# EAGLE design SwitchBoard_MP3_40 (EAGLE 9.6.2)
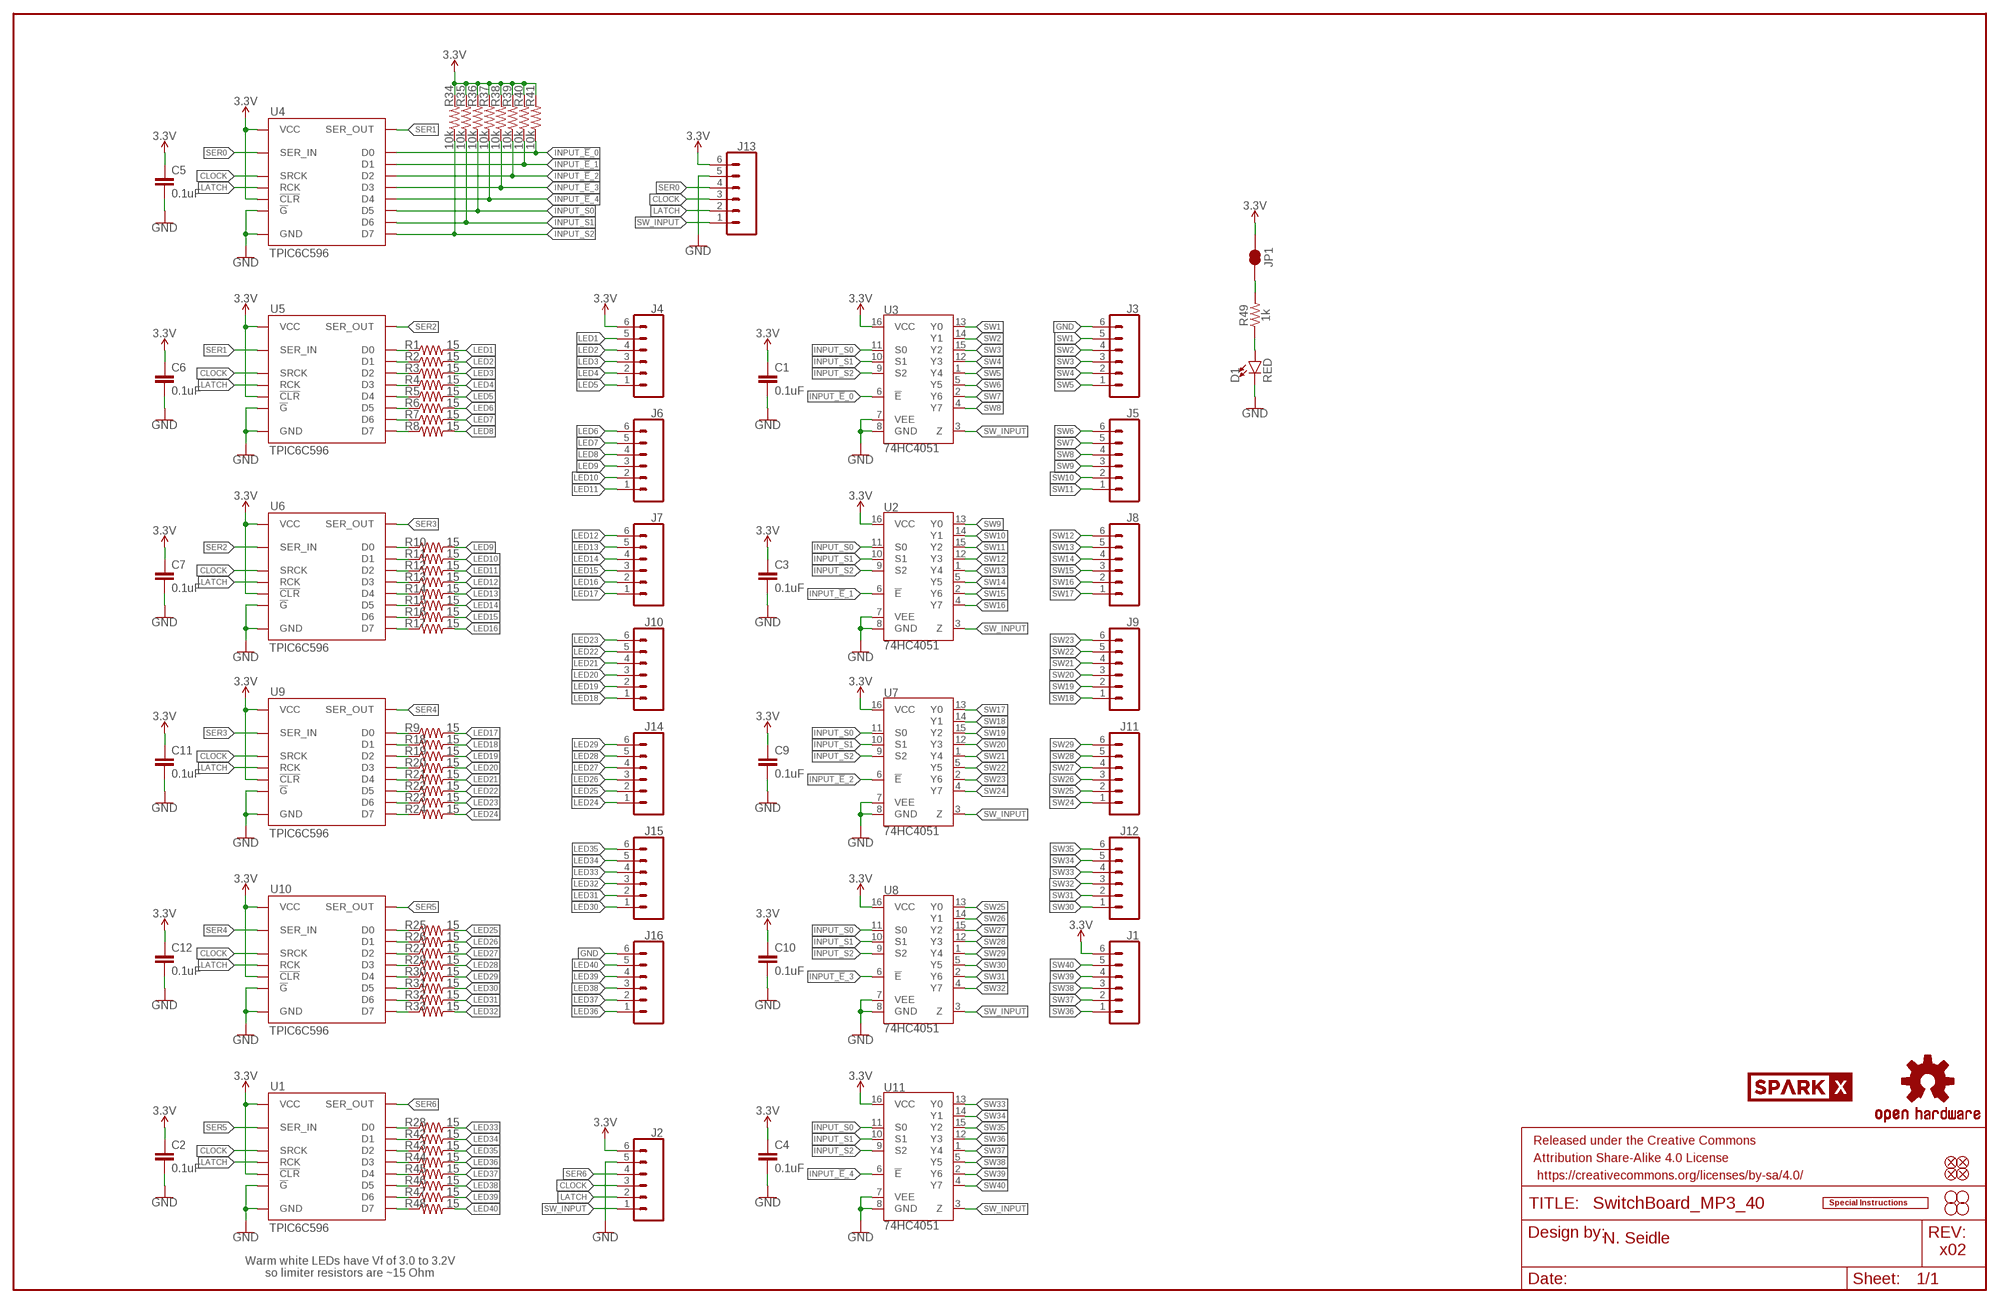
[diagram p0: schematic, sheet 1]

## Parts
C1  0.1uF  0.1UF-0603-25V-10%-X7R-WE  [0603]
C2  0.1uF  0.1UF-0603-25V-10%-X7R-WE  [0603]
C3  0.1uF  0.1UF-0603-25V-10%-X7R-WE  [0603]
C4  0.1uF  0.1UF-0603-25V-10%-X7R-WE  [0603]
C5  0.1uF  0.1UF-0603-25V-10%-X7R-WE  [0603]
C6  0.1uF  0.1UF-0603-25V-10%-X7R-WE  [0603]
C7  0.1uF  0.1UF-0603-25V-10%-X7R-WE  [0603]
C9  0.1uF  0.1UF-0603-25V-10%-X7R-WE  [0603]
C10  0.1uF  0.1UF-0603-25V-10%-X7R-WE  [0603]
C11  0.1uF  0.1UF-0603-25V-10%-X7R-WE  [0603]
C12  0.1uF  0.1UF-0603-25V-10%-X7R-WE  [0603]
D1  RED  LED-RED0603  [LED-0603]
FD1  FIDUCIAL1X2  [FIDUCIAL-1X2]
FD2  FIDUCIAL1X2  [FIDUCIAL-1X2]
FD3  FIDUCIAL1X2  [FIDUCIAL-1X2]
FD4  FIDUCIAL1X2  [FIDUCIAL-1X2]
FRAME2  FRAME-LEDGER  [CREATIVE_COMMONS]
H1  STAND-OFF  [STAND-OFF]
H2  STAND-OFF  [STAND-OFF]
H3  STAND-OFF  [STAND-OFF]
H4  STAND-OFF  [STAND-OFF]
J1  CONN_06JST-SMD-LOCKING  [JST-6-SMD-1.25MM-LOCKING]
J2  CONN_06JST-SMD-LOCKING  [JST-6-SMD-1.25MM-LOCKING]
J3  CONN_06JST-SMD-LOCKING  [JST-6-SMD-1.25MM-LOCKING]
J4  CONN_06JST-SMD-LOCKING  [JST-6-SMD-1.25MM-LOCKING]
J5  CONN_06JST-SMD-LOCKING  [JST-6-SMD-1.25MM-LOCKING]
J6  CONN_06JST-SMD-LOCKING  [JST-6-SMD-1.25MM-LOCKING]
J7  CONN_06JST-SMD-LOCKING  [JST-6-SMD-1.25MM-LOCKING]
J8  CONN_06JST-SMD-LOCKING  [JST-6-SMD-1.25MM-LOCKING]
J9  CONN_06JST-SMD-LOCKING  [JST-6-SMD-1.25MM-LOCKING]
J10  CONN_06JST-SMD-LOCKING  [JST-6-SMD-1.25MM-LOCKING]
J11  CONN_06JST-SMD-LOCKING  [JST-6-SMD-1.25MM-LOCKING]
J12  CONN_06JST-SMD-LOCKING  [JST-6-SMD-1.25MM-LOCKING]
J13  CONN_06JST-SMD-LOCKING  [JST-6-SMD-1.25MM-LOCKING]
J14  CONN_06JST-SMD-LOCKING  [JST-6-SMD-1.25MM-LOCKING]
J15  CONN_06JST-SMD-LOCKING  [JST-6-SMD-1.25MM-LOCKING]
J16  CONN_06JST-SMD-LOCKING  [JST-6-SMD-1.25MM-LOCKING]
JP1  JUMPER-SMT_2_NC_TRACE_SILK  [SMT-JUMPER_2_NC_TRACE_SILK]
LOGO1  SPECIAL_INSTRUCTIONS-ORDERING  [ORDERING_INSTRUCTIONS]
LOGO2  OSHW-LOGOS  [OSHW-LOGO-S]
R1  15  15OHM-0603-1/10W-1%  [0603]
R2  15  15OHM-0603-1/10W-1%  [0603]
R3  15  15OHM-0603-1/10W-1%  [0603]
R4  15  15OHM-0603-1/10W-1%  [0603]
R5  15  15OHM-0603-1/10W-1%  [0603]
R6  15  15OHM-0603-1/10W-1%  [0603]
R7  15  15OHM-0603-1/10W-1%  [0603]
R8  15  15OHM-0603-1/10W-1%  [0603]
R9  15  15OHM-0603-1/10W-1%  [0603]
R10  15  15OHM-0603-1/10W-1%  [0603]
R11  15  15OHM-0603-1/10W-1%  [0603]
R12  15  15OHM-0603-1/10W-1%  [0603]
R13  15  15OHM-0603-1/10W-1%  [0603]
R14  15  15OHM-0603-1/10W-1%  [0603]
R15  15  15OHM-0603-1/10W-1%  [0603]
R16  15  15OHM-0603-1/10W-1%  [0603]
R17  15  15OHM-0603-1/10W-1%  [0603]
R18  15  15OHM-0603-1/10W-1%  [0603]
R19  15  15OHM-0603-1/10W-1%  [0603]
R20  15  15OHM-0603-1/10W-1%  [0603]
R21  15  15OHM-0603-1/10W-1%  [0603]
R22  15  15OHM-0603-1/10W-1%  [0603]
R23  15  15OHM-0603-1/10W-1%  [0603]
R24  15  15OHM-0603-1/10W-1%  [0603]
R25  15  15OHM-0603-1/10W-1%  [0603]
R26  15  15OHM-0603-1/10W-1%  [0603]
R27  15  15OHM-0603-1/10W-1%  [0603]
R28  15  15OHM-0603-1/10W-1%  [0603]
R29  15  15OHM-0603-1/10W-1%  [0603]
R30  15  15OHM-0603-1/10W-1%  [0603]
R31  15  15OHM-0603-1/10W-1%  [0603]
R32  15  15OHM-0603-1/10W-1%  [0603]
R33  15  15OHM-0603-1/10W-1%  [0603]
R34  10k  10KOHM-0603-1/10W-1%  [0603]
R35  10k  10KOHM-0603-1/10W-1%  [0603]
R36  10k  10KOHM-0603-1/10W-1%  [0603]
R37  10k  10KOHM-0603-1/10W-1%  [0603]
R38  10k  10KOHM-0603-1/10W-1%  [0603]
R39  10k  10KOHM-0603-1/10W-1%  [0603]
R40  10k  10KOHM-0603-1/10W-1%  [0603]
R41  10k  10KOHM-0603-1/10W-1%  [0603]
R42  15  15OHM-0603-1/10W-1%  [0603]
R43  15  15OHM-0603-1/10W-1%  [0603]
R44  15  15OHM-0603-1/10W-1%  [0603]
R45  15  15OHM-0603-1/10W-1%  [0603]
R46  15  15OHM-0603-1/10W-1%  [0603]
R47  15  15OHM-0603-1/10W-1%  [0603]
R48  15  15OHM-0603-1/10W-1%  [0603]
R49  1k  1KOHM-0603-1/10W-1%  [0603]
U1  TPIC6C596  TPIC6C596SOIC  [SO016]
U2  74HC4051  744051  [SO16]
U3  74HC4051  744051  [SO16]
U4  TPIC6C596  TPIC6C596SOIC  [SO016]
U5  TPIC6C596  TPIC6C596SOIC  [SO016]
U6  TPIC6C596  TPIC6C596SOIC  [SO016]
U7  74HC4051  744051  [SO16]
U8  74HC4051  744051  [SO16]
U9  TPIC6C596  TPIC6C596SOIC  [SO016]
U10  TPIC6C596  TPIC6C596SOIC  [SO016]
U11  74HC4051  744051  [SO16]
U$1  SPARKX-LOGO4  [SPARKX-MEDIUM]

## Nets
3.3V: C1.1 C2.1 C3.1 C4.1 C5.1 C6.1 C7.1 C9.1 C10.1 C11.1 C12.1 J1.6 J2.6 J4.6 J13.6 JP1.2 R34.2 R35.2 R36.2 R37.2 R38.2 R39.2 R40.2 R41.2 U1.1(VCC) U1.7(!CLR) U2.16(VCC) U3.16(VCC) U4.1(VCC) U4.7(!CLR) U5.1(VCC) U5.7(!CLR) U6.1(VCC) U6.7(!CLR) U7.16(VCC) U8.16(VCC) U9.1(VCC) U9.7(!CLR) U10.1(VCC) U10.7(!CLR) U11.16(VCC)
CLOCK: J2.3 J13.3 U1.15(SRCK) U4.15(SRCK) U5.15(SRCK) U6.15(SRCK) U9.15(SRCK) U10.15(SRCK)
GND: C1.2 C2.2 C3.2 C4.2 C5.2 C6.2 C7.2 C9.2 C10.2 C11.2 C12.2 D1.C J2.5 J3.6 J13.5 J16.6 U1.8(!G) U1.16(GND) U2.7(VEE) U2.8(GND) U3.7(VEE) U3.8(GND) U4.8(!G) U4.16(GND) U5.8(!G) U5.16(GND) U6.8(!G) U6.16(GND) U7.7(VEE) U7.8(GND) U8.7(VEE) U8.8(GND) U9.8(!G) U9.16(GND) U10.8(!G) U10.16(GND) U11.7(VEE) U11.8(GND)
INPUT_!E!_0: R41.1 U3.6(!E!) U4.3(D0)
INPUT_!E!_1: R40.1 U2.6(!E!) U4.4(D1)
INPUT_!E!_2: R39.1 U4.5(D2) U7.6(!E!)
INPUT_!E!_3: R38.1 U4.6(D3) U8.6(!E!)
INPUT_!E!_4: R37.1 U4.11(D4) U11.6(!E!)
INPUT_S0: R36.1 U2.11(S0) U3.11(S0) U4.12(D5) U7.11(S0) U8.11(S0) U11.11(S0)
INPUT_S1: R35.1 U2.10(S1) U3.10(S1) U4.13(D6) U7.10(S1) U8.10(S1) U11.10(S1)
INPUT_S2: R34.1 U2.9(S2) U3.9(S2) U4.14(D7) U7.9(S2) U8.9(S2) U11.9(S2)
LATCH: J2.2 J13.2 U1.10(RCK) U4.10(RCK) U5.10(RCK) U6.10(RCK) U9.10(RCK) U10.10(RCK)
LED1: J4.5 R1.2
LED2: J4.4 R2.2
LED3: J4.3 R3.2
LED4: J4.2 R4.2
LED5: J4.1 R5.2
LED6: J6.6 R6.2
LED7: J6.5 R7.2
LED8: J6.4 R8.2
LED9: J6.3 R10.2
LED10: J6.2 R11.2
LED11: J6.1 R12.2
LED12: J7.6 R13.2
LED13: J7.5 R14.2
LED14: J7.4 R15.2
LED15: J7.3 R16.2
LED16: J7.2 R17.2
LED17: J7.1 R9.2
LED18: J10.1 R18.2
LED19: J10.2 R19.2
LED20: J10.3 R20.2
LED21: J10.4 R21.2
LED22: J10.5 R22.2
LED23: J10.6 R23.2
LED24: J14.1 R24.2
LED25: J14.2 R25.2
LED26: J14.3 R26.2
LED27: J14.4 R27.2
LED28: J14.5 R29.2
LED29: J14.6 R30.2
LED30: J15.1 R31.2
LED31: J15.2 R32.2
LED32: J15.3 R33.2
LED33: J15.4 R28.2
LED34: J15.5 R42.2
LED35: J15.6 R43.2
LED36: J16.1 R44.2
LED37: J16.2 R45.2
LED38: J16.3 R46.2
LED39: J16.4 R47.2
LED40: J16.5 R48.2
N$1: R1.1 U5.3(D0)
N$2: R2.1 U5.4(D1)
N$3: R3.1 U5.5(D2)
N$4: R4.1 U5.6(D3)
N$5: R5.1 U5.11(D4)
N$6: R6.1 U5.12(D5)
N$7: R7.1 U5.13(D6)
N$8: R8.1 U5.14(D7)
N$9: R9.1 U9.3(D0)
N$10: R10.1 U6.3(D0)
N$11: R11.1 U6.4(D1)
N$12: R12.1 U6.5(D2)
N$13: R13.1 U6.6(D3)
N$14: R14.1 U6.11(D4)
N$15: R15.1 U6.12(D5)
N$16: R16.1 U6.13(D6)
N$17: R17.1 U6.14(D7)
N$18: R18.1 U9.4(D1)
N$19: R19.1 U9.5(D2)
N$20: R20.1 U9.6(D3)
N$21: R21.1 U9.11(D4)
N$22: R22.1 U9.12(D5)
N$23: R23.1 U9.13(D6)
N$24: R24.1 U9.14(D7)
N$25: R25.1 U10.3(D0)
N$26: R26.1 U10.4(D1)
N$27: R27.1 U10.5(D2)
N$28: R29.1 U10.6(D3)
N$29: R30.1 U10.11(D4)
N$30: R31.1 U10.12(D5)
N$31: R32.1 U10.13(D6)
N$32: R33.1 U10.14(D7)
N$33: R28.1 U1.3(D0)
N$34: R42.1 U1.4(D1)
N$35: R43.1 U1.5(D2)
N$36: R44.1 U1.6(D3)
N$37: R45.1 U1.11(D4)
N$38: R46.1 U1.12(D5)
N$39: R47.1 U1.13(D6)
N$40: R48.1 U1.14(D7)
N$41: D1.A R49.1
N$42: JP1.1 R49.2
SER0: J13.4 U4.2(SER_IN)
SER1: U4.9(SER_OUT) U5.2(SER_IN)
SER2: U5.9(SER_OUT) U6.2(SER_IN)
SER3: U6.9(SER_OUT) U9.2(SER_IN)
SER4: U9.9(SER_OUT) U10.2(SER_IN)
SER5: U1.2(SER_IN) U10.9(SER_OUT)
SER6: J2.4 U1.9(SER_OUT)
SW1: J3.5 U3.13(Y0)
SW2: J3.4 U3.14(Y1)
SW3: J3.3 U3.15(Y2)
SW4: J3.2 U3.12(Y3)
SW5: J3.1 U3.1(Y4)
SW6: J5.6 U3.5(Y5)
SW7: J5.5 U3.2(Y6)
SW8: J5.4 U3.4(Y7)
SW9: J5.3 U2.13(Y0)
SW10: J5.2 U2.14(Y1)
SW11: J5.1 U2.15(Y2)
SW12: J8.6 U2.12(Y3)
SW13: J8.5 U2.1(Y4)
SW14: J8.4 U2.5(Y5)
SW15: J8.3 U2.2(Y6)
SW16: J8.2 U2.4(Y7)
SW17: J8.1 U7.13(Y0)
SW18: J9.1 U7.14(Y1)
SW19: J9.2 U7.15(Y2)
SW20: J9.3 U7.12(Y3)
SW21: J9.4 U7.1(Y4)
SW22: J9.5 U7.5(Y5)
SW23: J9.6 U7.2(Y6)
SW24: J11.1 U7.4(Y7)
SW25: J11.2 U8.13(Y0)
SW26: J11.3 U8.14(Y1)
SW27: J11.4 U8.15(Y2)
SW28: J11.5 U8.12(Y3)
SW29: J11.6 U8.1(Y4)
SW30: J12.1 U8.5(Y5)
SW31: J12.2 U8.2(Y6)
SW32: J12.3 U8.4(Y7)
SW33: J12.4 U11.13(Y0)
SW34: J12.5 U11.14(Y1)
SW35: J12.6 U11.15(Y2)
SW36: J1.1 U11.12(Y3)
SW37: J1.2 U11.1(Y4)
SW38: J1.3 U11.5(Y5)
SW39: J1.4 U11.2(Y6)
SW40: J1.5 U11.4(Y7)
SW_INPUT: J2.1 J13.1 U2.3(Z) U3.3(Z) U7.3(Z) U8.3(Z) U11.3(Z)

## Notes on the sheet
- N. Seidle
- x02
- Warm white LEDs have Vf of 3.0 to 3.2V
  so limiter resistors are ~15 Ohm

## Library data of the parts
C1-C7 C9-C12 = SparkFun-Capacitors:0.1UF: 0.1µF ceramic capacitors A capacitor is a passive two-terminal electrical component used to store electrical energy temporarily in an electric field.; PROD_ID: CAP-16503
D1 = SparkFun-LED:LED-RED: Red SMD LED Used in manufacturing of most products at SparkFun Packages: 0603 - SMD 0603 package [Product Link] <http://docs.avagotech.com/docs/AV02-0551EN> 0603 SMART - SMD 0603 SMART package ( more efficient and expensive)[Product Link] <http://www.osram-os.com/Graphics/XPic2/00077099_0.pdf> 1206 - SMD1206 package [Product Link] <https://www.sparkfun.com/datasheets/DevTools/LilyPad/Q150OVS4.pdff> SparkFun Products: Pro Mini 328 -5V <https://www.sparkfun.com/products/821> RedBoard <https://www.sparkfun.com/products/12757> IOIO-OTG <https://www.sparkfun.com/products/13613>; PROD_ID: DIO-00819
FD1-FD4 = SparkFun-Aesthetics:FIDUCIAL: Fiducial Alignment Points Point-of-reference for pick-and-place machines and other optical instruments.
FRAME2 = SparkFun-Aesthetics:FRAME-LEDGER: Schematic Frame - Ledger Standard 11x14 US Ledger frame
H1-H4 = SparkFun-Hardware:STAND-OFF: Stand Off Drill holes for mechanically mounting via screws, standoffs, etc. Note: Use the keepout ring to avoid running the screw head into surrounding components. Variant Overviews STAND-OFF - Mechanical footprint for a #4 phillips button head screw. STAND-OFF-TIGHT - Mechanical footprint for a #4 phillips button head screw, Example SparkFun Products Screw - Phillips Head (1/4", 4-40, 10 pack) <https://www.sparkfun.com/products/10453> (PRT-10453) Screw - Phillips Head (1/2", 4-40, 10 pack) <https://www.sparkfun.com/products/10452> (PRT-10452) Screw - Phillips Head (3/4", 4-40, 10 pack) <https://www.sparkfun.com/products/10451> (PRT-10451) Screw - Phillips Head (1", 4-40, 10 pack) <https://www.sparkfun.com/products/10450> (PRT-10450)
J1-J16 = SparkFun-Connectors:CONN_06: Multi connection point. Often used as Generic Header-pin footprint for 0.1 inch spaced/style header connections On any of the 0.1 inch spaced packages, you can populate with these: Break Away Headers - Straight <https://www.sparkfun.com/products/116> (PRT-00116) Break Away Male Headers - Right Angle <https://www.sparkfun.com/products/553> (PRT-00553) Female Headers <https://www.sparkfun.com/products/115> (PRT-00115) Break Away Headers - Machine Pin <https://www.sparkfun.com/products/117> (PRT-00117) Break Away Female Headers - Swiss Machine Pin <https://www.sparkfun.com/products/743> (PRT-00743) Arduino Stackable Header - 6 Pin <https://www.sparkfun.com/products/9280> (PRT-09280) Screw Terminals 2.54mm Pitch (6-Pin) <https://www.sparkfun.com/products/16499> (PRT-16499) For SCREWTERMINALS and SPRING TERMINALS visit here: Screw Terimnals on SparkFun.com <https://www.sparkfun.com/search/results?term=Screw+Terminals> (5mm/3.5mm/2.54mm spacing) This device is also useful as a general connection point to wire up your design to another part of your project. Our various solder wires solder well into these plated through hole pads. Hook-Up Wire - Assortment (Stranded, 22 AWG) <https://www.sparkfun.com/products/11375> (PRT-11375) Hook-Up Wire - Assortment (Solid Core, 22 AWG) <https://www.sparkfun.com/products/11367> (PRT-11367) View the entire wire category on our website here <https://www.sparkfun.com/categories/141>; PROD_ID: CONN-16497
JP1 = SparkFun-Jumpers:JUMPER-SMT_2_NC_TRACE: Normally closed trace jumper This jumper has a trace between two pads so it's normally closed (NC). Use a razor knife to open the connection. For best results follow the IPC guidelines for cutting traces: Cutout at least 0.063 mm (0.005 in). Remove all loose material to clean up the cut area. Seal the cut with an approved epoxy. Reapply solder to reclose the connection.
LOGO1 = SparkFun-Aesthetics:SPECIAL_INSTRUCTIONS: Special Ordering/Production Instructions Alert Symbol for special PCB ordering instructions or unique production process warnings. Ordering Instructions Production Instructions Types of information that should be added to box: Copper weight Soldermask color Silk color PCB thickness Number of layers PCB Standard: 1.6mm FR4 1 oz copper immersion silver plating red soldermask white silkscreen Types of information that should be added to box: Special wash requirements Depaneling instructions Humidification Glue curing Default text settings: 0.07 inch 9% ratio 50% line distance
LOGO2 = SparkFun-Aesthetics:OSHW-LOGO: Open-Source Hardware (OSHW) Logo This logo indicates the piece of hardware it is found on incorporates a OSHW license and/or adheres to the definition of open source hardware found here: http://freedomdefined.org/OSHW
R1-R33 R42-R48 = SparkFun-Resistors:15OHM: 15Ω resistor A resistor is a passive two-terminal electrical component that implements electrical resistance as a circuit element. Resistors act to reduce current flow, and, at the same time, act to lower voltage levels within circuits. - Wikipedia; PROD_ID: RES-12570
R34-R41 = SparkFun-Resistors:10KOHM: 10kΩ resistor A resistor is a passive two-terminal electrical component that implements electrical resistance as a circuit element. Resistors act to reduce current flow, and, at the same time, act to lower voltage levels within circuits. - Wikipedia; PROD_ID: RES-00824
R49 = SparkFun-Resistors:1KOHM: 1kΩ resistor A resistor is a passive two-terminal electrical component that implements electrical resistance as a circuit element. Resistors act to reduce current flow, and, at the same time, act to lower voltage levels within circuits. - Wikipedia; PROD_ID: RES-07856
U1 U4-U6 U9 U10 = SparkFun-DigitalIC:TPIC6C596: SMD version of the popular sink driver. This version can sink up to 100mA per channel; PROD_ID: IC-12522
U2 U3 U7 U8 U11 = AnalogMux:74*4051: NXP 74HC4051 8-Channel Analog Multiplexer/Demultiplexer The 74HC4051; 74HCT4051 is a single-pole octal-throw analog switch (SP8T) suitable for use in analog or digital 8:1 multiplexer/demultiplexer applications. The switch features three digital select inputs (S0, S1 and S2), eight independent inputs/outputs (Yn), a common input/output (Z) and a digital enable input (E). When E is HIGH, the switches are turned off. Inputs include clamp diodes. This enables the use of current limiting resistors to interface inputs to voltages in excess of VCC. Datasheet <http://www.nxp.com/documents/data_sheet/74HC_HCT4051.pdf>
U$1 = SparkX:SPARKX-LOGO

## Net classes
1 power: width 0.254 mm

## Board
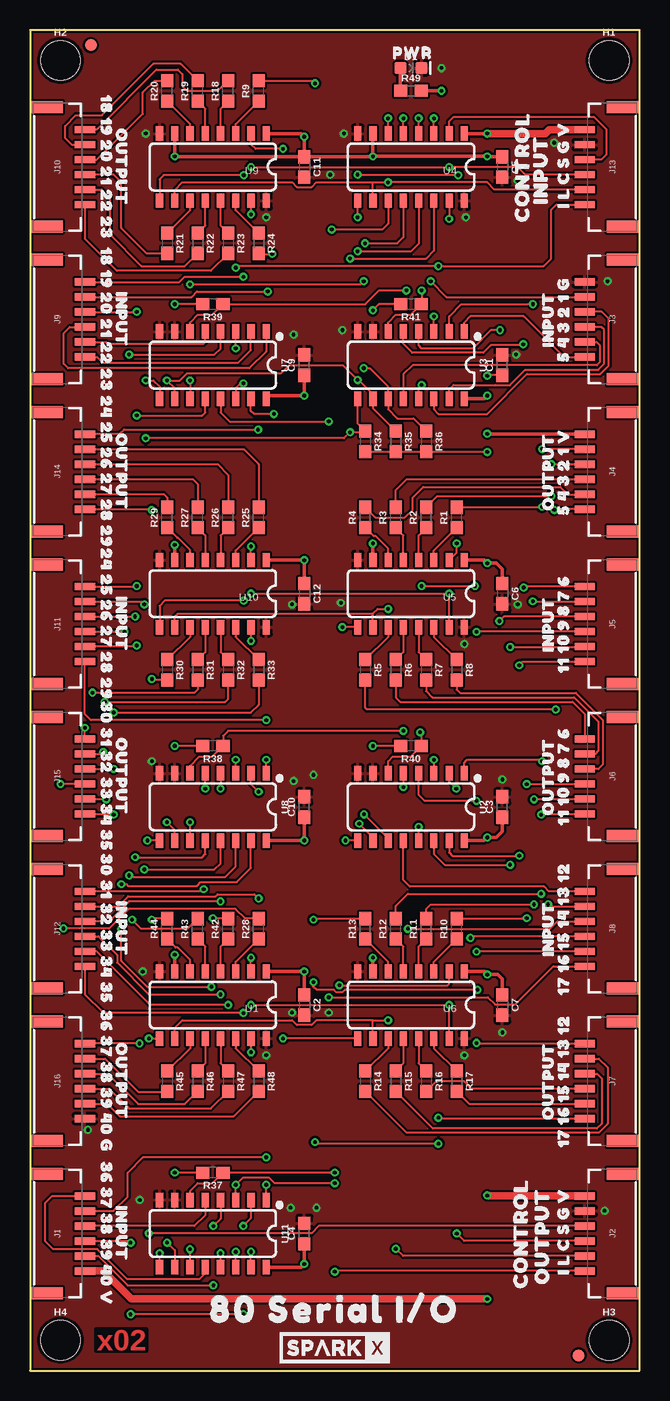
[diagram p1: board, top side]
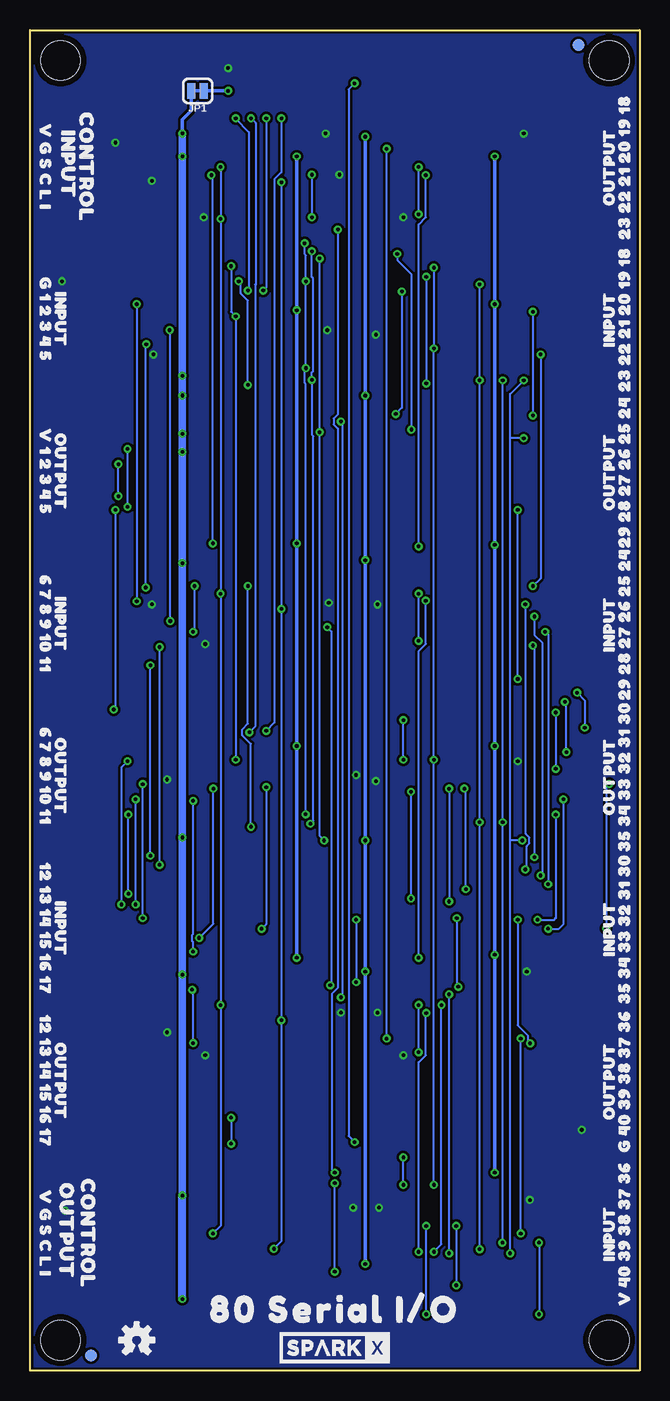
[diagram p2: board, bottom side, seen from below]

Size 50.8 x 111.76 mm. Coordinates in mm from the lower left corner, seen from the top.
Outline: 0,0 50.8,0 50.8,111.76 0,111.76 0,0
Copper layers (1*16): Top 0.035mm / dielectric 1.5mm / Bottom 0.035mm
Design rules "SparkFun-2-Layer-General-JLCPCB": minimum track width 7mil, minimum drill 0.3mm, track to track 7mil, track to pad 7mil, pad to pad 7mil, via to via 7mil, smd to smd 7mil, copper to edge 7mil, drill to drill 7mil, minimum pad ring 7mil, minimum via ring 7mil, stop-mask expansion 3mil, vias tented up to drill 25mil, thermal gap 10mil

### Footprints (pad centres in the part's own frame; a part is rotated, then mirrored left to right if it is on the bottom)
0603 = smd 1.1 x 1: 1 -0.85,0; 2 0.85,0
LED-0603 = smd 1 x 1: A -0.877,0; C 0.877,0
FIDUCIAL-1X2 = smd 1 x 1: 1 0,0
STAND-OFF = hole 3.302: 0,0
JST-6-SMD-1.25MM-LOCKING = smd 0.6 x 1.7: 1 -3.125,3.3; 2 -1.875,3.3; 3 -0.625,3.3; 4 0.625,3.3; 5 1.875,3.3; 6 3.125,3.3 | smd 1 x 2.7: NC1 4.975,0.1; NC2 -4.975,0.1
SMT-JUMPER_2_NC_TRACE_SILK = smd 0.66 x 1.27: 1 -0.521,0; 2 0.521,0
SO016 = smd 0.6 x 1.2: 1 -4.445,-2.8; 2 -3.175,-2.8; 3 -1.905,-2.8; 4 -0.635,-2.8; 5 0.635,-2.8; 6 1.905,-2.8; 7 3.175,-2.8; 8 4.445,-2.8; 9 4.445,2.8; 10 3.175,2.8; 11 1.905,2.8; 12 0.635,2.8; 13 -0.635,2.8; 14 -1.905,2.8; 15 -3.175,2.8; 16 -4.445,2.8
SO16 = smd 0.6 x 1.2: 1 -4.445,-2.8; 2 -3.175,-2.8; 3 -1.905,-2.8; 4 -0.635,-2.8; 5 0.635,-2.8; 6 1.905,-2.8; 7 3.175,-2.8; 8 4.445,-2.8; 9 4.445,2.8; 10 3.175,2.8; 11 1.905,2.8; 12 0.635,2.8; 13 -0.635,2.8; 14 -1.905,2.8; 15 -3.175,2.8; 16 -4.445,2.8

### Placement (x,y rotation side)
C1  39.37,83.82 90 top
C2  22.86,30.48 270 top
C3  39.37,46.99 90 top
C4  22.86,11.43 90 top
C5  39.37,100.33 270 top
C6  39.37,64.77 270 top
C7  39.37,30.48 270 top
C9  22.86,83.82 90 top
C10  22.86,46.99 90 top
C11  22.86,100.33 270 top
C12  22.86,64.77 270 top
D1  31.75,108.58 0 top
FD1  5.08,110.49 0 top
FD2  5.08,110.49 0 bottom
FD3  45.72,1.27 0 top
FD4  45.72,1.27 0 bottom
FRAME2  21.59,-8.89 0 top  (outside the outline)
H1  48.26,109.22 0 top
H2  2.54,109.22 0 top
H3  48.26,2.54 0 top
H4  2.54,2.54 0 top
J1  1.27,11.43 270 top
J2  49.53,11.43 90 top
J3  49.53,87.63 90 top
J4  49.53,74.93 90 top
J5  49.53,62.23 90 top
J6  49.53,49.53 90 top
J7  49.53,24.13 90 top
J8  49.53,36.83 90 top
J9  1.27,87.63 270 top
J10  1.27,100.33 270 top
J11  1.27,62.23 270 top
J12  1.27,36.83 270 top
J13  49.53,100.33 90 top
J14  1.27,74.93 270 top
J15  1.27,49.53 270 top
J16  1.27,24.13 270 top
JP1  36.83,106.68 180 bottom
LOGO1  69.24,58.55 0 top  (outside the outline)
LOGO2  41.91,2.54 0 bottom
R1  35.56,71.12 90 top
R2  33.02,71.12 90 top
R3  30.48,71.12 90 top
R4  27.94,71.12 90 top
R5  27.94,58.42 270 top
R6  30.48,58.42 270 top
R7  33.02,58.42 270 top
R8  35.56,58.42 270 top
R9  19.05,106.68 90 top
R10  35.56,36.83 90 top
R11  33.02,36.83 90 top
R12  30.48,36.83 90 top
R13  27.94,36.83 90 top
R14  27.94,24.13 270 top
R15  30.48,24.13 270 top
R16  33.02,24.13 270 top
R17  35.56,24.13 270 top
R18  16.51,106.68 90 top
R19  13.97,106.68 90 top
R20  11.43,106.68 90 top
R21  11.43,93.98 270 top
R22  13.97,93.98 270 top
R23  16.51,93.98 270 top
R24  19.05,93.98 270 top
R25  19.05,71.12 90 top
R26  16.51,71.12 90 top
R27  13.97,71.12 90 top
R28  19.05,36.83 90 top
R29  11.43,71.12 90 top
R30  11.43,58.42 270 top
R31  13.97,58.42 270 top
R32  16.51,58.42 270 top
R33  19.05,58.42 270 top
R34  27.94,77.47 270 top
R35  30.48,77.47 270 top
R36  33.02,77.47 270 top
R37  15.24,16.51 180 top
R38  15.24,52.07 180 top
R39  15.24,88.9 180 top
R40  31.75,52.07 180 top
R41  31.75,88.9 180 top
R42  16.51,36.83 90 top
R43  13.97,36.83 90 top
R44  11.43,36.83 90 top
R45  11.43,24.13 270 top
R46  13.97,24.13 270 top
R47  16.51,24.13 270 top
R48  19.05,24.13 270 top
R49  31.75,106.68 0 top
U1  15.24,30.48 180 top
U2  31.75,46.99 180 top
U3  31.75,83.82 180 top
U4  31.75,100.33 180 top
U5  31.75,64.77 180 top
U6  31.75,30.48 180 top
U7  15.24,83.82 180 top
U8  15.24,46.99 180 top
U9  15.24,100.33 180 top
U10  15.24,64.77 180 top
U11  15.24,11.43 180 top
U$1  25.4,1.91 0 top
U$2  [5_4_3_2_1_V0]  44.45,74.93 90 top
U$3  [OUTPUT1]  7.62,24.13 270 top
U$4  [INPUT0]  7.62,11.43 270 top
U$5  [11_10_9_8_7_60]  44.45,49.53 90 top
U$6  [INPUT0]  7.62,36.83 270 top
U$7  [OUTPUT1]  7.62,49.53 270 top
U$8  [INPUT0]  7.62,62.23 270 top
U$9  [INPUT0]  7.62,87.63 270 top
U$10  SPARKX-LOGO4  [SPARKX-MEDIUM]  25.4,1.91 0 bottom
U$11  [OUTPUT1]  7.62,74.93 270 top
U$12  [OUTPUT1]  7.62,100.33 270 top
U$13  [11_10_9_8_7_60]  44.45,62.23 90 top
U$14  [5_4_3_2_1_G0]  44.45,87.63 90 top
U$15  [17_16_15_14_13_120]  44.45,36.83 90 top
U$16  [17_16_15_14_13_120]  44.45,24.13 90 top
U$17  [_I_L_C_S_G_V0]  44.45,100.33 90 top
U$18  [_I_L_C_S_G_V0]  44.45,11.43 90 top
U$19  [OUTPUT_0]  42.67,11.43 90 top
U$20  [OUTPUT1]  48.26,49.53 270 bottom
U$21  [OUTPUT1]  43.18,74.93 90 top
U$22  [18_19_20_21_22_230]  6.35,100.33 270 top
U$23  [18_19_20_21_22_230]  6.35,87.63 270 top
U$24  [INPUT0]  43.18,87.63 90 top
U$25  [OUTPUT1]  43.18,49.53 90 top
U$26  [INPUT0]  43.18,62.23 90 top
U$27  [24_25_26_27_28_290]  6.35,74.93 270 top
U$28  [24_25_26_27_28_290]  6.35,62.23 270 top
U$29  [30_31_32_33_34_350]  6.35,49.53 270 top
U$30  [30_31_32_33_34_350]  6.35,36.83 270 top
U$31  [OUTPUT1]  43.18,24.13 90 top
U$32  [INPUT0]  43.18,36.83 90 top
U$33  [G_40_39_38_37_360]  1.27,24.13 90 bottom
U$34  [36_37_38_39_40_G0]  6.35,24.13 270 top
U$35  [80_SERIAL_I#O0]  25.4,5.08 0 top
U$36  [80_SERIAL_I#O0]  25.4,5.08 0 bottom
U$37  [CONTROL2]  40.89,11.43 90 top
U$38  [CONTROL2]  41.02,100.33 90 top
U$39  [INPUT_1]  42.55,100.33 90 top
U$40  [OUTPUT1]  48.26,24.13 270 bottom
U$41  [OUTPUT1]  2.54,24.13 90 bottom
U$42  [OUTPUT1]  2.54,49.53 90 bottom
U$43  [OUTPUT1]  2.54,74.93 90 bottom
U$44  [OUTPUT1]  2.54,100.33 90 bottom
U$45  [OUTPUT1]  48.26,74.93 270 bottom
U$46  [INPUT0]  48.26,87.63 270 bottom
U$47  [INPUT0]  48.26,62.23 270 bottom
U$48  [INPUT0]  48.26,36.83 270 bottom
U$49  [36_37_38_39_40_V0]  6.35,11.43 270 top
U$50  [INPUT0]  2.54,11.43 90 bottom
U$51  [INPUT0]  2.54,36.83 90 bottom
U$52  [INPUT0]  2.54,62.23 90 bottom
U$53  [INPUT0]  2.54,87.63 90 bottom
U$54  [INPUT_1]  47.62,100.33 270 bottom
U$55  [CONTROL2]  46.1,100.33 270 bottom
U$56  [CONTROL2]  45.97,11.43 270 bottom
U$57  [OUTPUT_0]  47.75,11.43 270 bottom
U$58  [V_40_39_38_37_360]  1.27,11.43 90 bottom
U$59  [35_34_33_32_31_300]  1.27,36.83 90 bottom
U$60  [35_34_33_32_31_300]  1.27,49.53 90 bottom
U$61  [29_28_27_26_25_240]  1.27,62.23 90 bottom
U$62  [29_28_27_26_25_240]  1.27,74.93 90 bottom
U$63  [23_22_21_20_19_180]  1.27,87.63 90 bottom
U$64  [23_22_21_20_19_180]  1.27,100.33 90 bottom
U$65  [V_G_S_C_L_I0]  49.53,11.43 270 bottom
U$66  [12_13_14_15_16_170]  49.53,24.13 270 bottom
U$67  [12_13_14_15_16_170]  49.53,36.83 270 bottom
U$68  [6_7_8_9_10_110]  49.53,49.53 270 bottom
U$69  [6_7_8_9_10_110]  49.53,62.23 270 bottom
U$70  [V_1_2_3_4_50]  49.53,74.93 270 bottom
U$71  [V_G_S_C_L_I0]  49.53,100.33 270 bottom
U$72  [G_1_2_3_4_50]  49.53,87.63 270 bottom
U$73  [PWR0]  31.88,109.86 0 top

### Tracks (layer width: path | path; a pad name or v marks a point on that pad's centre or on a via)
3.3V  (via drill 0.3)
  Top 0.178: R37.2 v12.06,16.51 | R38.2 v12.06,52.07 | R39.2 v12.06,88.9 | R41.2 29.08,88.9 v28.57,88.39 | R40.2 v28.57,52.07 | R34.2 R35.2 R36.2 38.06,76.62 v38.1,76.58 | C1.1 38.14,82.97 v38.1,82.93
  Top 0.305: U4.1 v38.09,103.13 v38.1,103.12 | U6.1 37.84,33.28 v38.1,33.02 38.99,33.02 39.37,32.64 C7.1 | U2.16 37.84,44.19 v38.1,44.45 38.86,44.45 39.37,44.96 C3.1 | U5.1 37.84,67.57 v38.1,67.31 38.86,67.31 39.37,66.8 C6.1 | U3.16 37.84,81.02 v38.1,81.28 | U4.7 v28.57,101.22 | C11.1 v22.86,102.87 22.6,103.13 U9.1 | U6.7 v28.57,34.42 | U9.7 v12.06,101.22 12.1,101.18 C11.1 | C4.1 v22.86,8.89 22.6,8.63 U11.16 | U1.1 v22.85,33.28 v22.86,33.27 C2.1 | U8.16 v22.85,44.19 v22.86,44.2 C10.1 | U10.1 v22.85,67.57 v22.86,67.56 C12.1 | U7.16 19.95,81.28 v22.86,81.28 C9.1 | U1.7 v12.06,34.67 | U10.7 v12.06,68.83 | U5.7 v28.57,68.96 | J4.6 38.15,78.06 v38.1,78.11 | C11.1 28.54,101.18 v28.57,101.22 | v28.57,101.22 v38.1,101.22 38.14,101.18 C5.1
  Top 0.61: v38.1,103.12 42.93,103.12 43.26,103.45 J13.6 | J1.6 6.09,8.3 8.43,5.97 v38.1,5.97 | v38.1,14.61 38.15,14.55 J2.6
  Bottom 0.305: v28.57,101.22 v28.57,88.39 v28.57,68.96 v28.57,52.07 v28.57,34.42 | v12.06,101.22 v12.06,88.9 v12.06,68.83 v12.06,52.07 v12.06,34.67 v12.06,16.51 | v22.86,102.87 v22.86,81.28 v22.86,67.56 v22.86,44.2 v22.86,33.27 v22.86,8.89 | v38.1,103.12 38.1,104.27 37.35,105.02 JP1.2
  Bottom 0.61: v38.1,103.12 v38.1,101.22 v38.1,82.93 v38.1,81.28 v38.1,78.11 v38.1,76.58 v38.1,67.31 v38.1,44.45 v38.1,33.02 v38.1,14.61
  Bottom 0.66: v38.1,5.97 v38.1,14.61
CLOCK  (via drill 0.3)
  Top 0.178: J13.3 41.27,99.7 40.64,100.33 v34.92,100.33 v18.41,100.33 | v18.41,30.48 v34.92,30.48 U6.15 | J2.3 36.19,10.8 v35.56,11.43 | U5.15 v34.92,64.77 v18.41,64.77 | U10.15 v18.41,60.83 | U9.15 v18.41,96.39 | U4.15 v34.92,96.01 | U1.15 v18.41,26.54
  Bottom 0.178: v34.92,100.33 v34.92,96.01 v34.92,64.77 v34.92,30.48 34.92,12.06 v35.56,11.43 | v18.41,60.83 v18.41,64.77 | v18.41,96.39 v18.41,100.33 | v18.41,26.54 v18.41,30.48
GND  (via drill 0.3)
  other vias: 25.02,99.69 9.65,103.12 19.68,96.14 26.16,103.12 36.32,96.14 40.64,99.19 43.69,102.36 21.97,86.36 26.04,86.74 48.13,90.81 25.91,64.01 36.2,60.58 40.64,63.88 10.16,50.8 21.97,49.15 24.89,29.84 21.84,29.84 19.68,26.29 9.4,33.27 47.88,13.34 21.72,13.59 23.88,13.59 9.14,14.22 36.2,26.29 39.37,28.19 39.37,49.28 23.62,49.66 21.84,63.88 40.51,84.71 4.83,20.07 34.29,108.58
  pour Bottom (isolate 0.203): 0,0 0,111.76 50.8,111.76 50.8,0
  pour Top: 0,0 0,111.76 50.8,111.76 50.8,0
INPUT_!E!_0  (via drill 0.3)
  Top 0.178: U3.6 29.84,87.38 30.48,88.01 31.71,88.01 R41.1 32.64,88.94 v32.64,90.04 | U4.3 v33.66,104.39
  Bottom 0.178: v33.66,104.39 33.66,104.35 32.55,103.24 32.55,90.13 v32.64,90.04
INPUT_!E!_1  (via drill 0.3)
  Top 0.178: U2.6 29.84,50.8 30.23,51.18 31.71,51.18 R40.1 32.6,53.12 v32.51,53.21 | U4.4 v32.38,104.39
  Bottom 0.178: v32.38,104.39 32,104.01 32,90.51 32.04,90.54 32.04,53.68 v32.51,53.21
INPUT_!E!_2  (via drill 0.3)
  Top 0.178: U7.6 13.34,87.38 13.97,88.01 15.2,88.01 R39.1 27.94,88.9 29.08,90.04 v31.37,90.04 | U4.5 v31.11,104.39
  Bottom 0.178: v31.11,104.39 31.11,90.3 v31.37,90.04
INPUT_!E!_3  (via drill 0.3)
  Top 0.178: U8.6 13.34,50.42 14.1,51.18 15.2,51.18 R38.1 16.09,52.92 16.51,53.34 v31.11,53.34 | U4.6 v29.84,104.39
  Bottom 0.178: v29.84,104.39 29.84,99.9 30.44,99.31 30.44,54.01 v31.11,53.34
INPUT_!E!_4  (via drill 0.3)
  Top 0.178: U11.6 13.34,14.99 13.97,15.62 15.2,15.62 R37.1 v25.4,16.51 | U4.11 29.84,95.63 29.34,95.12 v25.15,95.12
  Bottom 0.178: v25.4,16.51 25.65,16.76 25.65,31.41 25.15,31.92 25.15,78.53 25.49,78.87 25.49,79.37 25.15,79.71 v25.15,95.12
INPUT_S0  (via drill 0.3)
  Top 0.178: U11.11 v13.34,10.12 | v13.34,82.55 U7.11 | v27.81,83.57 28.32,83.57 29.84,82.04 U3.11 29.84,80.14 30.61,79.38 31.96,79.38 R36.1 | v27.81,90.81 27.56,90.55 v13.34,90.55 | U8.11 v13.34,45.72 | U2.11 29.84,44.37 v27.83,46.38 | v27.91,93.98 30.61,93.98 31.11,94.49 U4.12
  Bottom 0.178: v13.34,10.12 v13.34,45.72 v13.34,82.55 v13.34,90.55 | v27.83,46.38 27.83,82.27 27.9,82.34 27.9,83.48 v27.81,83.57 v27.81,90.81 27.81,92.97 27.9,93.06 27.9,93.97 v27.91,93.98
INPUT_S1  (via drill 0.3)
  Top 0.178: R35.1 28.57,80.22 U3.10 28.57,81.41 27.39,82.59 v27.3,82.59 26.07,83.82 21.59,83.82 20.92,83.15 13.09,83.15 12.49,82.55 v11.4,82.55 12.06,81.89 U7.10 | v11.43,10.67 12.06,10.03 U11.10 | U8.10 12.06,45.06 v11.4,45.72 | U2.10 28.57,44.45 v27.43,45.59 | v27.3,93.31 31.75,93.31 32.38,93.94 U4.13
  Bottom 0.178: v11.4,82.55 11.4,82.32 11.43,82.3 11.43,45.72 | 11.43,45.72 v11.43,10.67 | v11.4,45.72 11.43,45.72 | v27.43,45.59 27.18,45.85 27.18,77.9 27.27,77.98 27.27,82.55 v27.3,82.59 27.3,83.23 27.22,83.32 27.22,91.05 27.3,91.14 v27.3,93.31
INPUT_S2  (via drill 0.3)
  Top 0.178: U3.9 27.3,78.95 R34.1 27.85,78.23 v26.67,78.23 26.16,77.72 v9.65,77.72 | U11.9 v10.79,9.78 | v9.65,82.55 10.29,82.55 10.79,82.04 U7.9 | U8.9 v9.78,44.2 | U2.9 v26.3,44.19 v26.29,44.2 | v26.67,92.71 33.02,92.71 33.66,93.34 U4.14
  Bottom 0.178: v10.79,9.78 U8.9 | U8.9 10.79,77.72 | 10.79,77.72 10.79,81.41 v9.65,82.55 | v9.78,44.2 U8.9 | v26.29,44.2 26.67,44.58 v26.67,78.23 v26.67,92.71 | v9.65,77.72 10.79,77.72
LATCH  (via drill 0.3)
  Top 0.178: J13.2 38.7,98.45 38.1,99.06 v29.84,99.06 28.57,99.06 | U6.10 28.57,29.21 | 28.57,29.21 23.87,29.21 23.47,28.81 22.25,28.81 21.85,29.21 12.7,29.21 12.06,28.57 U1.10 | 28.57,29.21 v29.84,29.21 | U10.10 12.06,62.87 12.3,63.1 28.57,63.1 | U9.10 12.06,98.42 12.7,99.06 21.85,99.06 22.25,98.66 23.47,98.66 23.87,99.06 28.57,99.06 | U4.10 28.57,99.06 | J2.2 31.09,9.55 v30.48,10.16 | U5.10 28.57,63.1 | 28.57,63.1 28.97,63.5 v29.84,63.5
  Bottom 0.178: v29.84,99.06 v29.84,63.5 v29.84,29.21 29.84,10.79 v30.48,10.16
LED1  (via drill 0.3)
  Top 0.178: R1.2 42.63,71.97 v42.67,72.01 | J4.5 42.7,76.81 v42.67,76.83
  Bottom 0.178: v42.67,72.01 v42.67,76.83
LED2  (via drill 0.3)
  Top 0.178: R2.2 33.95,72.9 v43.43,72.9 | v43.43,75.56 J4.4
  Bottom 0.178: v43.43,72.9 v43.43,75.56
LED3
  Top 0.178: R3.2 30.48,73.41 31.38,74.31 J4.3
LED4
  Top 0.178: R4.2 28.79,71.12 31.24,71.12 31.88,71.75 31.88,72.77 32.77,73.66 44.2,73.66 44.83,73.03 46.2,73.03 J4.2
LED5  (via drill 0.3)
  Top 0.178: J4.1 43.74,71.81 v43.69,71.75 | v43.81,55.12 28.07,55.12 27.94,55.24 R5.2
  Bottom 0.178: v43.69,71.75 43.69,55.24 v43.81,55.12
LED6
  Top 0.178: R6.2 30.48,56.13 30.86,55.75 45.21,55.75 46.23,54.73 J6.6
LED7
  Top 0.178: R7.2 33.02,56.64 33.53,56.13 45.34,56.13 47.37,54.1 47.37,51.69 47.09,51.41 J6.5
LED8
  Top 0.178: R8.2 35.56,56.77 35.84,56.49 45.49,56.49 47.73,54.25 47.73,50.52 47.36,50.16 J6.4
LED9  (via drill 0.3)
  Top 0.178: R10.2 41.36,37.68 v41.4,37.72 | v41.4,48.9 41.41,48.91 J6.3
  Bottom 0.178: v41.4,37.72 v41.4,48.9
LED10  (via drill 0.3)
  Top 0.178: R11.2 33.02,38.48 33.4,38.86 v42,38.86 | v42,47.62 42.03,47.66 J6.2
  Bottom 0.178: v42,38.86 v42,47.62
LED11  (via drill 0.3)
  Top 0.178: R12.2 30.48,38.73 31.5,39.75 v42.6,39.75 | v42.6,46.35 42.65,46.41 J6.1
  Bottom 0.178: v42.6,39.75 v42.6,46.35
LED12  (via drill 0.3)
  Top 0.178: J7.6 37.26,27.25 v37.21,27.3 | v23.62,32.38 23.62,32 23.88,31.75 25.32,31.75 25.53,31.53 26.03,31.53 26.24,31.75 v37.29,31.75 | v23.62,37.59 23.71,37.68 R13.2
  Bottom 0.178: v37.21,27.3 37.21,31.67 v37.29,31.75 | v23.62,37.59 v23.62,32.38
LED13
  Top 0.178: J7.5 47.4,26 48.13,25.27 48.13,20.58 47.39,19.84 31.38,19.84 R14.2
LED14
  Top 0.178: J7.4 47.25,24.75 47.62,24.38 47.62,20.57 47.24,20.19 33.57,20.19 R15.2
LED15
  Top 0.178: J7.3 36.76,23.5 36.17,24.1 33.84,24.1 R16.2
LED16
  Top 0.178: R17.2 36.59,22.25 J7.2
LED17  (via drill 0.3)
  Top 0.178: J7.1 34.11,21 v34.04,21.08 | v34.04,18.92 23.88,18.92 v23.75,19.05 | R9.2 23.53,107.53 v23.75,107.31
  Bottom 0.178: v34.04,21.08 v34.04,18.92 | v23.75,19.05 24.26,19.56 24.26,106.81 v23.75,107.31
LED18
  Top 0.178: J10.1 4.62,103.5 5.59,103.5 10.54,108.46 12.32,108.46 12.7,108.08 12.7,107.06 13.08,106.68 15.66,106.68 R18.2
LED19
  Top 0.178: R19.2 12.56,108.94 10.29,108.94 5.99,104.65 3.81,104.65 2.92,103.76 2.92,102.74 3.46,102.2 J10.2
LED20
  Top 0.178: J10.3 5.58,100.95 9.4,104.78 9.4,106.55 10.38,107.53 R20.2
LED21
  Top 0.178: R21.2 9.74,93.13 7.62,95.25 7.62,99.06 6.97,99.7 J10.4
LED22
  Top 0.178: J10.5 5.94,98.45 6.63,97.77 6.63,94.72 9.28,92.08 12.91,92.08 R22.2
LED23
  Top 0.178: R23.2 15.07,91.69 7.24,91.69 4.57,94.36 J10.6
LED24  (via drill 0.3)
  Top 0.178: R24.2 19.09,93.09 v20.19,93.09 | J14.1 7.44,78.06 7.84,78.45 v19.01,78.45
  Bottom 0.178: v20.19,93.09 20.19,92.58 19.01,91.4 v19.01,78.45
LED25
  Top 0.178: J14.2 17.81,76.81 19.05,75.56 R25.2
LED26
  Top 0.178: J14.3 15.63,75.56 16.51,74.68 R26.2
LED27
  Top 0.178: J14.4 13.58,74.31 13.97,73.91 R27.2
LED28
  Top 0.178: J14.5 11.15,73.06 11.43,72.77 R29.2
LED29  (via drill 0.3)
  Top 0.178: R30.2 10.25,57.57 v10.16,57.66 | J14.6 10.11,71.81 v10.16,71.75
  Bottom 0.178: v10.16,57.66 v10.16,71.75
LED30  (via drill 0.3)
  Top 0.178: J15.1 v4.57,53.59 | v5.21,56.52 13.72,56.52 13.97,56.77 R31.2
  Bottom 0.178: v5.21,56.52 4.57,55.88 v4.57,53.59
LED31  (via drill 0.3)
  Top 0.178: v6.22,55.75 16.26,55.75 16.51,56.01 R32.2 | J15.2 5.94,51.41 v6.1,51.56
  Bottom 0.178: v6.1,51.56 6.1,55.63 v6.22,55.75
LED32  (via drill 0.3)
  Top 0.178: J15.3 6.97,50.16 v6.99,50.16 | v6.99,54.86 18.41,54.86 19.05,55.5 R33.2
  Bottom 0.178: v6.99,54.86 v6.99,50.16
LED33  (via drill 0.3)
  Top 0.178: R28.2 17.94,37.68 17.12,38.5 8.24,38.5 6.6,36.86 v2.79,36.86 | J15.4 4.56,48.9 v2.54,48.9
  Bottom 0.178: v2.54,48.9 2.79,48.64 v2.79,36.86
LED34  (via drill 0.3)
  Top 0.178: R42.2 15.28,37.68 v15.24,37.72 | v7.62,36.83 7.62,34.16 9.78,32 v15.11,32 | v6.35,47.62 4.6,47.62 J15.5
  Bottom 0.178: v6.35,47.62 6.35,37.21 6.73,36.83 v7.62,36.83 | v15.24,37.72 15.24,32.13 v15.11,32
LED35  (via drill 0.3)
  Top 0.178: R43.2 13.12,36.83 9.27,36.83 v8.51,37.59 | v6.99,46.35 4.62,46.35 J15.6
  Bottom 0.178: v8.51,37.59 7.11,37.59 6.99,37.72 v6.99,46.35
LED36  (via drill 0.3)
  Top 0.178: R44.2 10.25,37.68 v10.16,37.59 | v9.12,27.28 4.6,27.28 J16.1
  Bottom 0.178: v9.12,27.28 9.31,27.47 9.31,27.93 10.16,28.78 v10.16,37.59
LED37
  Top 0.178: J16.2 6.25,26 9.02,23.24 11.39,23.24 R45.2
LED38
  Top 0.178: J16.3 6.49,24.75 9.02,22.23 12.91,22.23 R46.2
LED39
  Top 0.178: J16.4 6.59,23.5 8.26,21.84 15.07,21.84 R47.2
LED40
  Top 0.178: J16.5 6.45,22.25 7.49,21.21 16.98,21.21 R48.2
N$1
  Top 0.178: U5.3 33.66,68.36 R1.1
N$2
  Top 0.178: U5.4 32.38,69.64 R2.1
N$3
  Top 0.178: U5.5 31.11,69.64 R3.1
N$4
  Top 0.178: R4.1 28.65,69.56 28.82,69.56 29.84,68.53 U5.6
N$5
  Top 0.178: U5.11 29.84,61.17 R5.1
N$6
  Top 0.178: U5.12 31.11,59.91 R6.1
N$7
  Top 0.178: U5.13 32.38,59.91 R7.1
N$8
  Top 0.178: U5.14 33.66,61.17 R8.1
N$9
  Top 0.178: U9.3 17.14,103.92 R9.1
N$10
  Top 0.178: U6.3 33.66,34.08 R10.1
N$11
  Top 0.178: U6.4 32.38,35.34 R11.1
N$12
  Top 0.178: U6.5 31.11,35.34 R12.1
N$13
  Top 0.178: U6.6 29.84,34.08 R13.1
N$14
  Top 0.178: U6.11 29.84,26.89 R14.1
N$15
  Top 0.178: U6.12 31.11,25.61 R15.1
N$16
  Top 0.178: U6.13 32.38,25.61 R16.1
N$17
  Top 0.178: U6.14 33.66,26.89 R17.1
N$18
  Top 0.178: U9.4 15.88,105.19 R18.1
N$19
  Top 0.178: U9.5 14.61,105.19 R19.1
N$20
  Top 0.178: U9.6 13.34,103.92 R20.1
N$21
  Top 0.178: R21.1 13.34,96.73 U9.11
N$22
  Top 0.178: R22.1 14.61,95.47 U9.12
N$23
  Top 0.178: R23.1 15.88,95.47 U9.13
N$24
  Top 0.178: R24.1 17.14,96.73 U9.14
N$25
  Top 0.178: U10.3 17.14,68.36 R25.1
N$26
  Top 0.178: R26.1 15.88,69.64 U10.4
N$27
  Top 0.178: R27.1 14.61,69.64 U10.5
N$28
  Top 0.178: R29.1 12.27,69.43 12.31,69.43 13.34,68.41 U10.6
N$29
  Top 0.178: U10.11 13.34,61.17 R30.1
N$30
  Top 0.178: U10.12 14.61,59.91 R31.1
N$31
  Top 0.178: U10.13 15.88,59.91 R32.1
N$32
  Top 0.178: U10.14 17.14,61.17 R33.1
N$33
  Top 0.178: U1.3 17.14,34.08 R28.1
N$34
  Top 0.178: U1.4 15.88,35.34 R42.1
N$35
  Top 0.178: U1.5 14.61,35.34 R43.1
N$36
  Top 0.178: R44.1 12.14,35.27 12.31,35.27 13.34,34.24 U1.6
N$37
  Top 0.178: U1.11 13.34,26.89 R45.1
N$38
  Top 0.178: U1.12 14.61,25.61 R46.1
N$39
  Top 0.178: U1.13 15.88,25.61 R47.1
N$40
  Top 0.178: U1.14 17.14,26.89 R48.1
N$41
  Top 0.305: R49.1 30.87,106.71 D1.A
N$42  (via drill 0.3)
  Top 0.305: v34.29,106.68 R49.2
  Bottom 0.305: JP1.1 v34.29,106.68
SER0
  Top 0.178: U4.2 34.92,104.15 35.3,104.52 46.99,104.52 48.01,103.5 48.01,101.35 47.62,100.95 J13.4
SER1  (via drill 0.3)
  Top 0.178: U5.2 35.56,68.2 v35.56,68.96 | v35.69,99.66 27.34,99.66 v27.3,99.69 | v27.3,96.14 U4.9
  Bottom 0.178: v35.56,68.96 35.56,99.53 v35.69,99.66 | v27.3,99.69 v27.3,96.14
SER2  (via drill 0.3)
  Top 0.178: U5.9 v26.04,61.97 v26.04,61.98 | v25.78,32.13 34.8,32.13 34.92,32.26 U6.2
  Bottom 0.178: v26.04,61.98 25.69,61.63 25.69,32.22 v25.78,32.13
SER3  (via drill 0.3)
  Top 0.178: U6.9 v21.09,27.68 v21.08,27.69 | v21.08,101.85 18.8,101.85 18.41,102.23 U9.2
  Bottom 0.178: v21.08,27.69 v21.08,101.85
SER4  (via drill 0.3)
  Top 0.178: U10.2 v18.41,68.71 | v17.82,99.66 11.14,99.66 10.79,99.31 U9.9
  Bottom 0.178: v18.41,68.71 18.41,95.55 17.82,96.15 v17.82,99.66
SER5  (via drill 0.3)
  Top 0.178: U1.2 v18.41,34.42 | v17.82,64.18 11.22,64.18 10.79,63.75 U10.9
  Bottom 0.178: v18.41,34.42 18.41,59.99 17.82,60.59 v17.82,64.18
SER6  (via drill 0.3)
  Top 0.178: J2.4 24.06,12.05 23.47,11.46 9.94,11.46 v9.91,11.43 | v9.91,27.69 U1.9
  Bottom 0.178: v9.91,11.43 v9.91,27.69
SW1  (via drill 0.3)
  Top 0.178: U3.13 32.38,81.92 v32.64,82.17 | v33.4,90.81 34.7,89.5 J3.5
  Bottom 0.178: v32.64,82.17 32.64,89.2 33.24,89.8 33.24,90.64 v33.4,90.81
SW2
  Top 0.178: U3.14 33.66,80.14 34.04,79.76 38.09,79.76 41.41,83.08 47.51,83.08 48.21,83.78 48.21,87.68 47.62,88.27 46.24,88.27 J3.4
SW3
  Top 0.178: U3.15 34.92,81.79 35.31,82.17 38.74,82.17 38.76,82.15 39.98,82.15 41.27,83.44 47.37,83.44 47.85,83.93 47.85,86.77 47.62,87 J3.3
SW4
  Top 0.178: J3.2 47.21,85.75 47.5,85.47 47.5,84.07 47.24,83.82 31.88,83.82 31.11,83.06 U3.12
SW5
  Top 0.178: U3.1 36.2,87.38 36.7,87.89 41.14,87.89 44.53,84.5 J3.1
SW6  (via drill 0.3)
  Top 0.178: J5.6 41.23,65.36 v41.15,65.28 | v41.11,85.56 41.04,85.49 38.41,85.49 37.79,84.86 31.85,84.86 31.11,85.6 U3.5
  Bottom 0.178: v41.15,65.28 41.15,85.56 v41.11,85.56
SW7  (via drill 0.3)
  Top 0.178: U3.2 34.92,87.88 35.94,88.9 v41.91,88.9 | v41.91,64.14 46.2,64.14 J5.5
  Bottom 0.178: v41.91,88.9 v41.91,64.14
SW8  (via drill 0.3)
  Top 0.178: J5.4 39.49,62.85 v39.12,62.48 | v39.17,86.74 38.41,86.74 36.88,85.22 32.64,85.22 32.38,85.47 U3.4
  Bottom 0.178: v39.12,62.48 39.12,86.69 v39.17,86.74
SW9  (via drill 0.3)
  Top 0.178: U2.13 v32.38,45.34 | v32.64,65.41 v37.08,65.41 | J5.3 37.22,61.6 v37.21,61.59
  Bottom 0.178: v32.38,45.34 32.38,52.24 33.11,52.97 33.11,53.46 32.64,53.93 v32.64,65.41 | v37.21,61.59 37.08,61.72 v37.08,65.41
SW10  (via drill 0.3)
  Top 0.178: U2.14 33.66,43.05 34.54,42.16 v40.01,42.16 | v40.01,60.33 46.2,60.33 J5.2
  Bottom 0.178: v40.01,42.16 v40.01,60.33
SW11  (via drill 0.3)
  Top 0.178: U2.15 34.92,43.18 35.18,42.93 v40.77,42.93 | v40.77,58.8 41.07,59.1 J5.1
  Bottom 0.178: v40.77,42.93 v40.77,58.8
SW12
  Top 0.178: J8.6 43.24,39.95 42.84,40.35 31.66,40.35 31.11,40.89 U2.12
SW13  (via drill 0.3)
  Top 0.178: U2.1 36.2,50.67 36.45,50.93 42.55,50.93 v42.67,50.8 | v43.18,38.86 43.34,38.7 J8.5
  Bottom 0.178: v43.18,38.86 43.18,39.49 43.19,39.5 43.19,50.28 v42.67,50.8
SW14  (via drill 0.3)
  Top 0.178: U2.5 v31.11,48.64 | v31.5,36.83 43.31,36.83 43.94,37.47 46.22,37.47 J8.4
  Bottom 0.178: v31.11,48.64 31.11,37.21 v31.5,36.83
SW15  (via drill 0.3)
  Top 0.178: J8.3 36.84,36.2 v36.7,36.07 | v35.52,48.51 34.92,49.11 U2.2
  Bottom 0.178: v36.7,36.07 35.52,37.25 v35.52,48.51
SW16  (via drill 0.3)
  Top 0.178: J8.2 37.24,34.95 v37.21,34.92 | v37.21,47.5 32.89,47.5 32.38,48.01 U2.4
  Bottom 0.178: v37.21,34.92 37.21,35.73 37.3,35.82 37.3,36.31 37.21,36.4 v37.21,47.5
SW17  (via drill 0.3)
  Top 0.178: U7.13 15.88,79.88 16.64,79.12 v24.89,79.12 | v24.89,31.11 38.16,31.11 38.76,30.51 40.42,30.51 43.61,33.7 J8.1
  Bottom 0.178: v24.89,31.11 24.77,31.24 24.77,78.99 v24.89,79.12
SW18  (via drill 0.3)
  Top 0.178: J9.1 12.44,90.75 12.88,91.19 v17.78,91.19 | v17.78,82.3 17.53,82.3 17.14,81.92 U7.14
  Bottom 0.178: v17.78,91.19 v17.78,82.3
SW19  (via drill 0.3)
  Top 0.178: J9.2 13.46,89.5 13.91,89.95 v19.81,89.95 | v20.32,79.76 18.67,79.76 18.41,80.01 U7.15
  Bottom 0.178: v19.81,89.95 19.81,80.26 v20.32,79.76
SW20  (via drill 0.3)
  Top 0.178: J9.3 8.88,88.25 v8.89,88.27 | v8.89,79.63 14.35,79.63 14.61,79.88 U7.12
  Bottom 0.178: v8.89,88.27 v8.89,79.63
SW21
  Top 0.178: U7.1 19.68,84.96 18.29,83.57 3.17,83.57 2.79,83.95 2.79,86.49 3.31,87 J9.4
SW22
  Top 0.178: J9.5 6.32,85.75 6.45,85.62 14.48,85.62 14.61,85.75 U7.5
SW23
  Top 0.178: J9.6 5.59,84.5 6.09,84 17.32,84 18.41,85.09 U7.2
SW24  (via drill 0.3)
  Top 0.178: J11.1 8.84,65.36 v8.89,65.41 | v8.26,84.71 15.37,84.71 15.88,85.22 U7.4
  Bottom 0.178: v8.26,84.71 8.26,66.04 v8.89,65.41
SW25  (via drill 0.3)
  Top 0.178: J11.2 9.3,64.11 v9.53,63.88 | v9.53,41.78 15.37,41.78 15.88,42.29 U8.13
  Bottom 0.178: v9.53,41.78 9.4,41.91 9.4,43.73 9.18,43.95 9.18,44.44 9.49,44.75 9.49,63.84 v9.53,63.88
SW26  (via drill 0.3)
  Top 0.178: J11.3 8.75,62.85 v8.76,62.87 | U8.14 17.14,42.04 16.26,41.15 8.64,41.15 8.51,41.27 v8.26,41.27
  Bottom 0.178: v8.76,62.87 8.76,61.34 8.13,60.71 8.13,41.4 v8.26,41.27
SW27  (via drill 0.3)
  Top 0.178: J11.4 7.86,61.6 v7.87,61.59 | v7.62,40.55 8.01,40.55 8.13,40.42 13.93,40.42 14.23,40.73 17.23,40.73 18.41,41.91 U8.15
  Bottom 0.178: v7.87,61.59 7.62,61.34 v7.62,40.55
SW28  (via drill 0.3)
  Top 0.178: J11.5 8.79,60.35 v8.89,60.45 | v8.76,42.8 14.35,42.8 14.61,43.05 U8.12 | v8.89,60.45
  Bottom 0.178: v8.76,42.8 8.76,60.33 v8.89,60.45
SW29  (via drill 0.3)
  Top 0.178: U8.1 v19.68,50.93 | v19.68,54.23 5.08,54.23 4.57,54.74 J11.6
  Bottom 0.178: v19.68,50.93 v19.68,54.23
SW30  (via drill 0.3)
  Top 0.178: v14.61,48.51 U8.5 | v14.48,40.13 14.3,39.95 J12.1
  Bottom 0.178: v14.61,48.51 14.48,48.39 v14.48,40.13
SW31  (via drill 0.3)
  Top 0.178: v19.05,48.26 18.41,48.9 U8.2 | J12.2 7.34,38.7 8.17,39.53 15.45,39.53 15.63,39.72 18.7,39.72 v19.05,39.37
  Bottom 0.178: v19.05,39.37 v19.05,48.26
SW32  (via drill 0.3)
  Top 0.178: U8.4 v15.88,48.51 | v15.88,39.12 8.26,39.12 6.59,37.45 J12.3
  Bottom 0.178: v15.88,48.51 v15.88,39.12
SW33  (via drill 0.3)
  Top 0.178: U11.13 v15.88,9.78 | v15.88,31.37 9.91,31.37 7.26,34.02 7.26,34.65 5.71,36.2 J12.4
  Bottom 0.178: v15.88,9.78 v15.88,31.37
SW34  (via drill 0.3)
  Top 0.178: U11.14 v17.14,9.91 | v16.51,30.48 10.03,30.48 5.56,34.95 J12.5
  Bottom 0.178: v17.14,9.91 16.51,10.54 v16.51,30.48
SW35  (via drill 0.3)
  Top 0.178: U11.15 v18.41,9.91 | v17.78,29.81 6.13,29.81 4.57,31.37 J12.6
  Bottom 0.178: v18.41,9.91 18.41,25.7 17.82,26.3 17.82,29.77 v17.78,29.81
SW36
  Top 0.178: J1.1 1.85,14.55 1.27,13.97 1.27,10.79 1.94,10.12 5.62,10.12 8.12,7.62 14.1,7.62 14.61,8.13 U11.12
SW37  (via drill 0.3)
  Top 0.178: U11.1 v19.68,15.49 | v19.68,17.78 9.4,17.78 8.13,16.51 8.13,14.48 6.96,13.3 J1.2
  Bottom 0.178: v19.68,15.49 v19.68,17.78
SW38
  Top 0.178: J1.3 13.71,12.05 14.61,12.95 U11.5
SW39  (via drill 0.3)
  Top 0.178: U11.2 18.41,12.7 v17.78,12.06 | J1.4 8.24,10.8 v8.38,10.67 | v17.78,4.7 v8.38,4.7
  Bottom 0.178: v17.78,4.7 v17.78,12.06 | v8.38,10.67 v8.38,4.7
SW40  (via drill 0.3)
  Top 0.178: U11.4 15.88,12.66 v15.28,12.06 | J1.5 5.68,9.55 8.13,7.11 v15.28,7.11
  Bottom 0.178: v15.28,12.06 v15.28,7.11
SW_INPUT  (via drill 0.3)
  Top 0.178: U3.3 v33.66,87.88 | J13.1 43.87,97.2 43.43,96.77 43.43,92.71 42.8,92.08 v34.04,92.08 17.27,92.08 v17.14,91.95 | U11.3 v17.14,15.49 17.74,16.09 19.93,16.09 20.4,15.62 v25.4,15.62 | v17.14,85.22 U7.3 | U8.3 v17.14,50.93 | v33.66,50.93 U2.3 | J2.1 25.45,8.3 v25.4,8.26
  Bottom 0.178: v34.04,92.08 34.04,88.27 v33.66,87.88 v33.66,50.93 | v17.14,15.49 v17.14,50.93 v17.14,85.22 v17.14,91.95 | v25.4,8.26 v25.4,15.62

### Text on the board
Top: x02
tDocu: 2-Layer PCB / 1.6mm Thickness / 1oz Copper / HASL Finish